# EAGLE schematic keypad-16x1 (EAGLE 7.7.0)
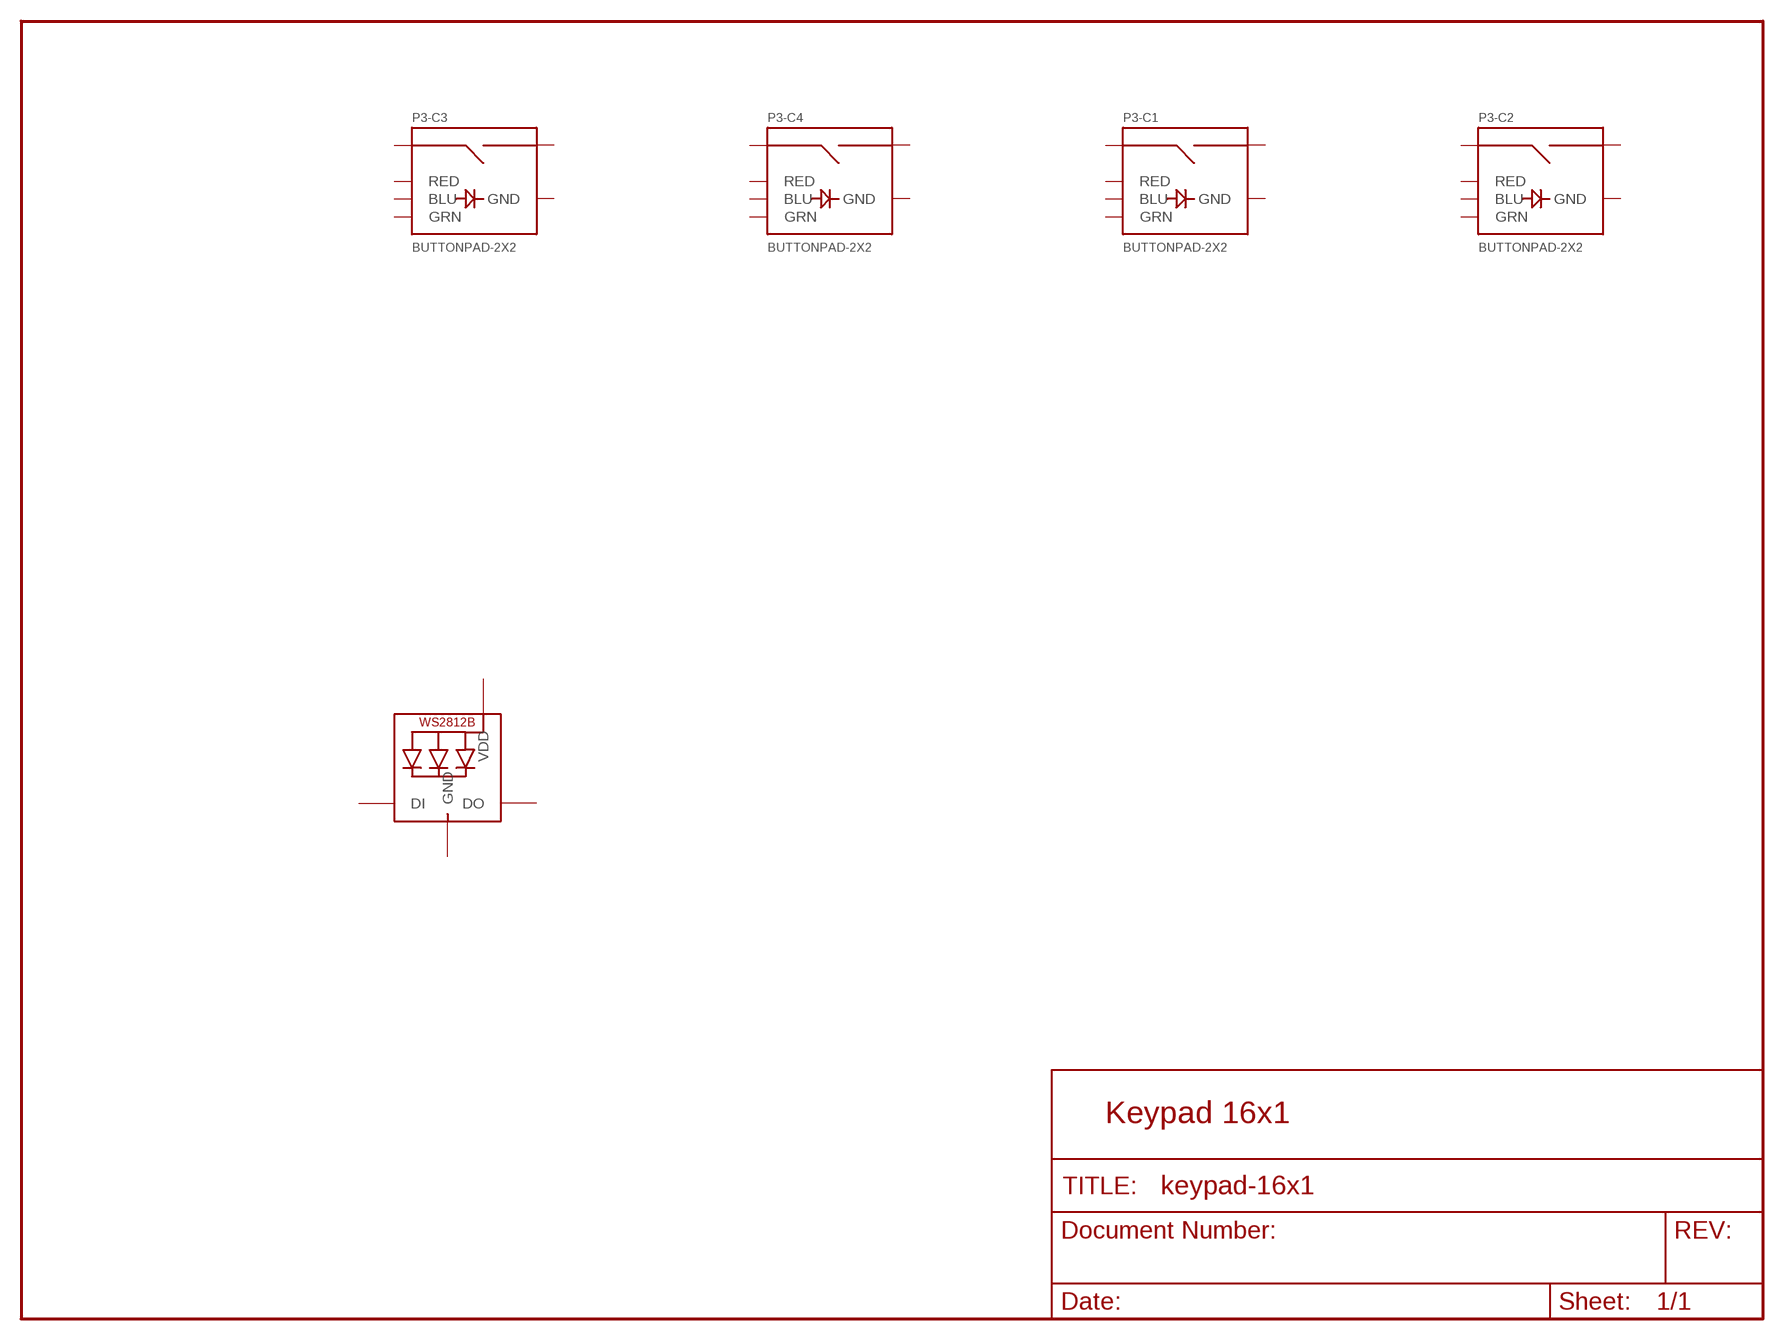
[diagram p0: schematic, sheet 1]

## Parts
LED1  WS2812B5050  [WS2812B]
P3  BUTTONPAD-2X2  [BUTTONPAD-2X2]
Unconnected: LED1.2-DOUT(DO) LED1.4-DIN(DI) P3.BLU1(-C1:BLU) P3.BLU2(-C2:BLU) P3.BLU3(-C3:BLU) P3.BLU4(-C4:BLU) P3.GND1(-C1:GND) P3.GND2(-C2:GND) P3.GND3(-C3:GND) P3.GND4(-C4:GND) P3.GRN1(-C1:GRN) P3.GRN2(-C2:GRN) P3.GRN3(-C3:GRN) P3.GRN4(-C4:GRN) P3.RED1(-C1:RED) P3.RED2(-C2:RED) P3.RED3(-C3:RED) P3.RED4(-C4:RED) P3.SIG1(-C1:SIG1) P3.SIG2(-C1:SIG2) P3.SIG3(-C2:SIG1) P3.SIG4(-C2:SIG2) P3.SIG5(-C3:SIG1) P3.SIG6(-C3:SIG2) P3.SIG7(-C4:SIG1) P3.SIG8(-C4:SIG2)

## Notes on the sheet
- Keypad 16x1

## Power pins joined to a net without a drawn wire
GND: LED1.3-GND(GND)
VDD: LED1.1-VDD(VDD)

## Library data of the parts
LED1 = adafruit:WS2812B
P3 = SparkFun:BUTTONPAD-2X2: 5mm Button Pad Proven layout and schematic for 2x2 button pad. Panelize this device/fp to a 4x4 pad if needed. Spark Fun Electronics SKU : COM-07835. Compatible common cathode tri-color LED SKU : COM-00105

## Net classes
0 Default: width 0.254 mm
1 Power: width 0.305 mm
2 LEDPower: width 0.305 mm
3 ButtonSignal: width 0.254 mm